# EAGLE design MAPE-CUN-Large-022 (EAGLE 7.3.0)
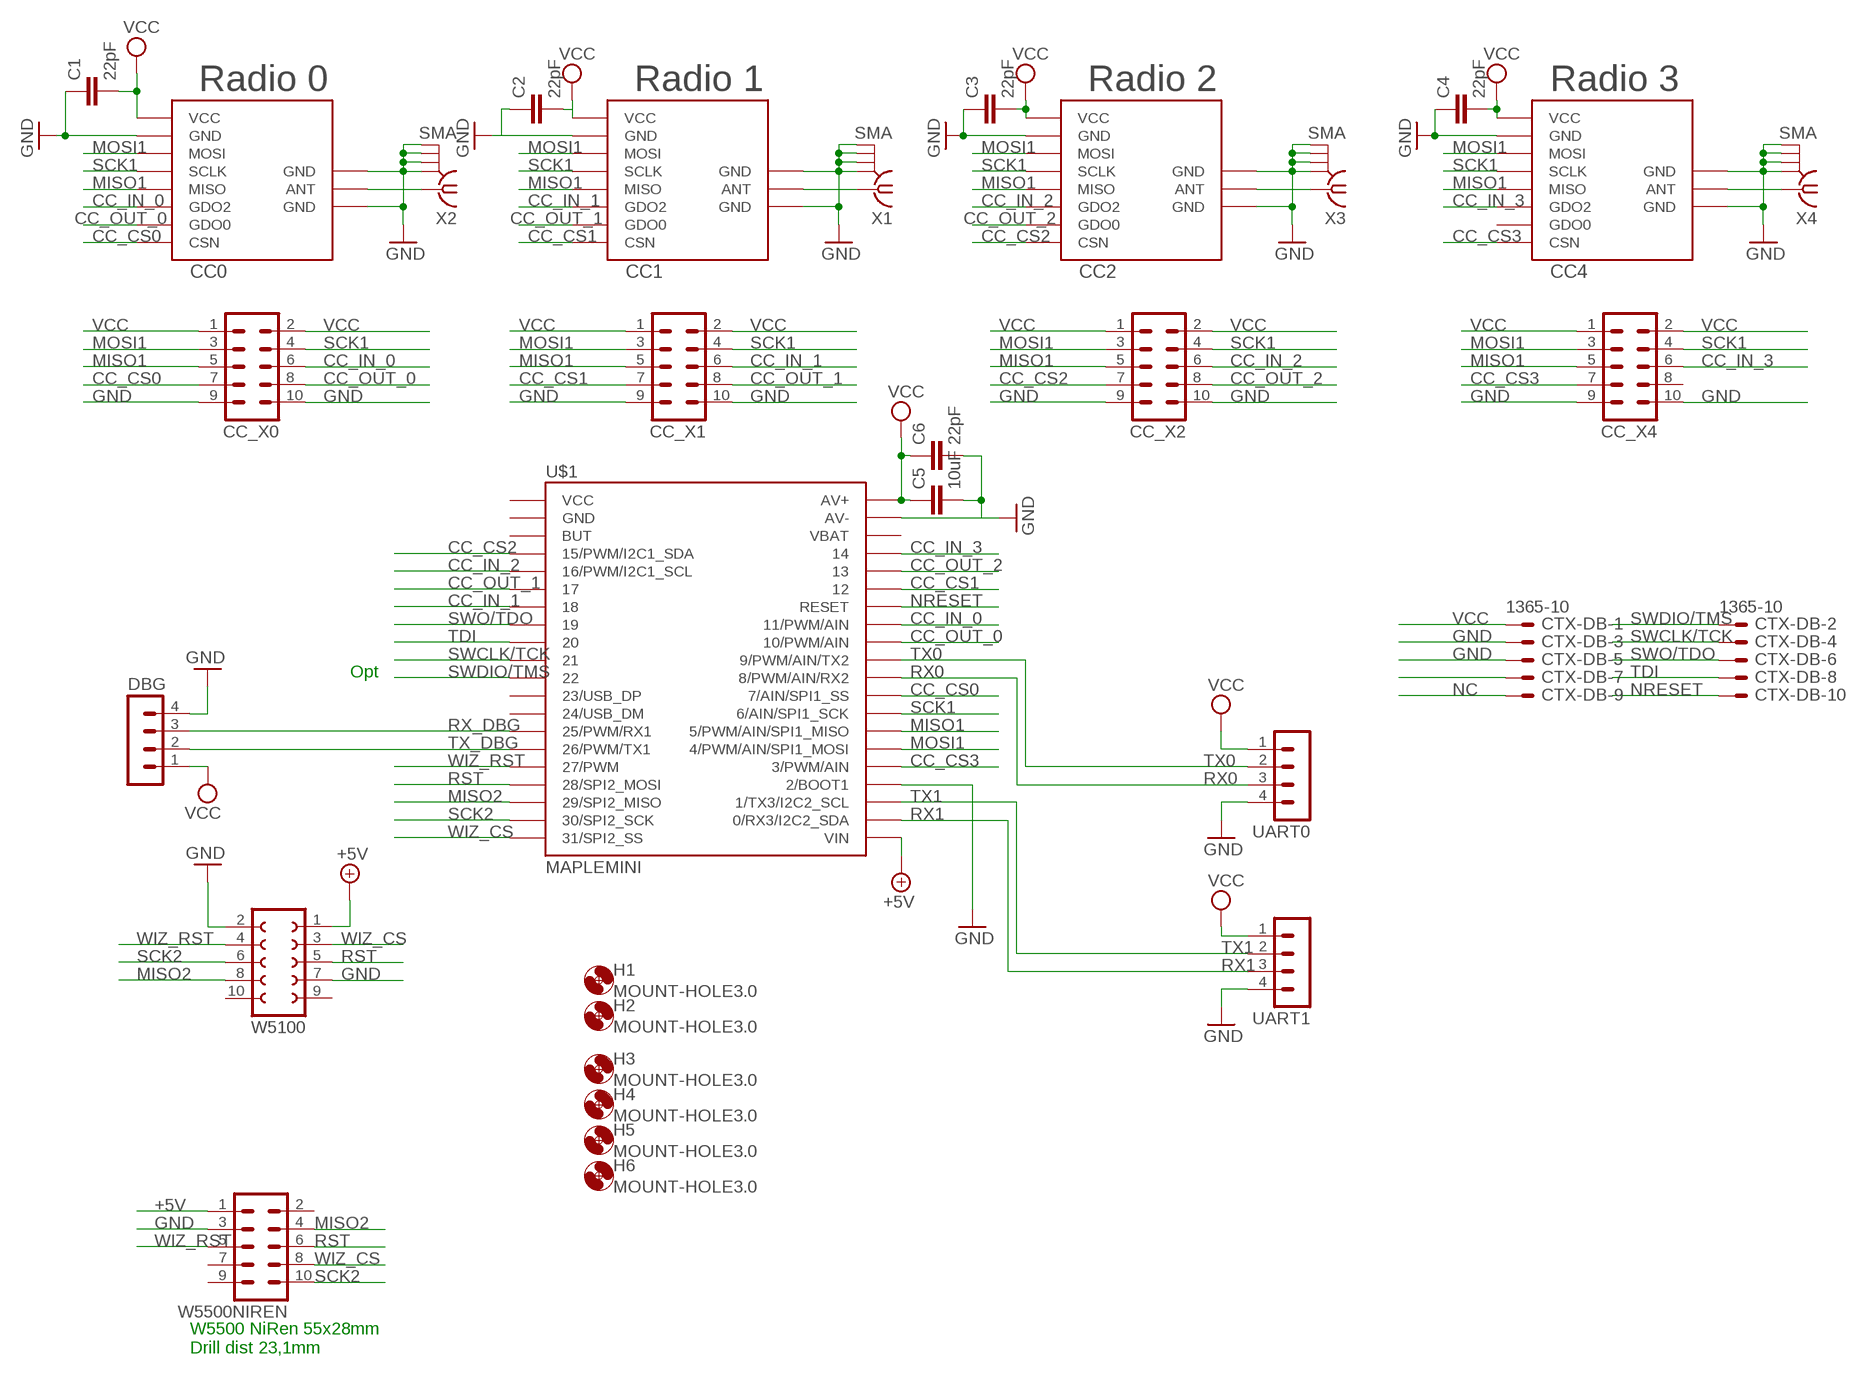
[diagram p0: schematic, sheet 1]

## Parts
C1  22pF  C-EUC0805  [C0805]
C2  22pF  C-EUC0805  [C0805]
C3  22pF  C-EUC0805  [C0805]
C4  22pF  C-EUC0805  [C0805]
C5  10uF  C-EUC1210  [C1210]
C6  22pF  C-EUC0805  [C0805]
CC0  CC1101_MODULE1SMD  [CC1101_MODULE1_SMD]
CC1  CC1101_MODULE1SMD  [CC1101_MODULE1_SMD]
CC2  CC1101_MODULE1SMD  [CC1101_MODULE1_SMD]
CC4  CC1101_MODULE1SMD  [CC1101_MODULE1_SMD]
CC_X0  MA05-2  [MA05-2]
CC_X1  MA05-2  [MA05-2]
CC_X2  MA05-2  [MA05-2]
CC_X4  MA05-2  [MA05-2]
CTX-DB  1365-10  [1365-10]
DBG  MA04-1  [MA04-1]
H1  MOUNT-HOLE3.0  [3,0]
H2  MOUNT-HOLE3.0  [3,0]
H3  MOUNT-HOLE3.0  [3,0]
H4  MOUNT-HOLE3.0  [3,0]
H5  MOUNT-HOLE3.0  [3,0]
H6  MOUNT-HOLE3.0  [3,0]
U$1  MAPLEMINI  [20-DIP]
UART0  MA04-1  [MA04-1]
UART1  MA04-1  [MA04-1]
W5100  FE05-2  [FE05-2]
W5500NIREN  MA05-2  [MA05-2]
X1  SMA  [SMA]
X2  SMA  [SMA]
X3  SMA  [SMA]
X4  SMA  [SMA]

## Nets
+5V: U$1.21(VIN) W5100.1 W5500NIREN.1
CC_CS0: CC0.CSN CC_X0.7 U$1.29(7/AIN/SPI1_SS)
CC_CS1: CC1.CSN CC_X1.7 U$1.35
CC_CS2: CC2.CSN CC_X2.7 U$1.4(15/PWM/I2C1_SDA)
CC_CS3: CC4.CSN CC_X4.7 U$1.25(3/PWM/AIN)
CC_IN_0: CC0.GDO2 CC_X0.6 U$1.33(11/PWM/AIN)
CC_IN_1: CC1.GDO2 CC_X1.6 U$1.7
CC_IN_2: CC2.GDO2 CC_X2.6 U$1.5(16/PWM/I2C1_SCL)
CC_IN_3: CC4.GDO2 CC_X4.6 U$1.37
CC_OUT_0: CC0.GDO0 CC_X0.8 U$1.32(10/PWM/AIN)
CC_OUT_1: CC1.GDO0 CC_X1.8 U$1.6
CC_OUT_2: CC2.GDO0 CC_X2.8 U$1.36
GND: C1.1 C2.1 C3.1 C4.1 C5.2 C6.2 CC0.GND@0(GND) CC0.GND@1(GND) CC0.GND@2(GND) CC1.GND@0(GND) CC1.GND@1(GND) CC1.GND@2(GND) CC2.GND@0(GND) CC2.GND@1(GND) CC2.GND@2(GND) CC4.GND@0(GND) CC4.GND@1(GND) CC4.GND@2(GND) CC_X0.9 CC_X0.10 CC_X1.9 CC_X1.10 CC_X2.9 CC_X2.10 CC_X4.9 CC_X4.10 CTX-DB.3 CTX-DB.5 DBG.4 U$1.24(2/BOOT1) U$1.39(AV-) UART0.4 UART1.4 W5100.2 W5100.7 W5500NIREN.3 X1.GND@1 X1.GND@2 X1.GND@3 X1.GND@4 X2.GND@1 X2.GND@2 X2.GND@3 X2.GND@4 X3.GND@1 X3.GND@2 X3.GND@3 X3.GND@4 X4.GND@1 X4.GND@2 X4.GND@3 X4.GND@4
MISO1: CC0.MISO CC1.MISO CC2.MISO CC4.MISO CC_X0.5 CC_X1.5 CC_X2.5 CC_X4.5 U$1.27(5/PWM/AIN/SPI1_MISO)
MISO2: U$1.18(29/SPI2_MISO) W5100.8 W5500NIREN.4
MOSI1: CC0.MOSI CC1.MOSI CC2.MOSI CC4.MOSI CC_X0.3 CC_X1.3 CC_X2.3 CC_X4.3 U$1.26(4/PWM/AIN/SPI1_MOSI)
N$1: CC2.ANT X3.1
N$2: CC4.ANT X4.1
N$3: CC1.ANT X1.1
N$4: CC0.ANT X2.1
N$8: CTX-DB.7
NC: CTX-DB.9
NRESET: CTX-DB.10 U$1.34(RESET)
RST: U$1.17(28/SPI2_MOSI) W5100.5 W5500NIREN.6
RX0: U$1.30(8/PWM/AIN/RX2) UART0.3
RX1: U$1.22(0/RX3/I2C2_SDA) UART1.3
RX_DBG: DBG.3 U$1.14(25/PWM/RX1)
SCK1: CC0.SCLK CC1.SCLK CC2.SCLK CC4.SCLK CC_X0.4 CC_X1.4 CC_X2.4 CC_X4.4 U$1.28(6/AIN/SPI1_SCK)
SCK2: U$1.19(30/SPI2_SCK) W5100.6 W5500NIREN.10
SWCLK/TCK: CTX-DB.4 U$1.10
SWDIO/TMS: CTX-DB.2 U$1.11
SWO/TDO: CTX-DB.6 U$1.8
TDI: CTX-DB.8 U$1.9
TX0: U$1.31(9/PWM/AIN/TX2) UART0.2
TX1: U$1.23(1/TX3/I2C2_SCL) UART1.2
TX_DBG: DBG.2 U$1.15(26/PWM/TX1)
VCC: C1.2 C2.2 C3.2 C4.2 C5.1 C6.1 CC0.VCC CC1.VCC CC2.VCC CC4.VCC CC_X0.1 CC_X0.2 CC_X1.1 CC_X1.2 CC_X2.1 CC_X2.2 CC_X4.1 CC_X4.2 CTX-DB.1 DBG.1 U$1.40(AV+) UART0.1 UART1.1
WIZ_CS: U$1.20(31/SPI2_SS) W5100.3 W5500NIREN.8
WIZ_RST: U$1.16(27/PWM) W5100.4 W5500NIREN.5
Unconnected: CC4.GDO0 CC_X4.8 U$1.1(VCC) U$1.2(GND) U$1.3(BUT) U$1.12(23/USB_DP) U$1.13(24/USB_DM) U$1.38(VBAT) W5100.9 W5100.10 W5500NIREN.2 W5500NIREN.7 W5500NIREN.9

## Notes on the sheet
- Radio 0 | Radio 1 | Radio 2 | Radio 3
- Opt
- W5500 NiRen 55x28mm
  Drill dist 23,1mm

## Library data of the parts
C1-C6 = rcl:C-EU: CAPACITOR, European symbol
CC0 CC1 CC2 CC4 = wireless:CC1101_MODULE1: CC1101 wireless module for 433/868 MHz (sold from Aliexpress). DIL version for mounting with pin header (and SMD soldering) and SMD only variant available.
CC_X0 CC_X1 CC_X2 CC_X4 W5500NIREN = con-lstb:MA05-2: PIN HEADER; OC_FARNELL: unknown; OC_NEWARK: unknown
CTX-DB = con-leotronics:1365-10: DUAL ROW STRAIGHT HEADER 1364 SERIES. 1.27mm x 1.27mm. Without Fixing Post. SMT Source: http://www.leotronics.co.uk/Conexcon/Data%20Sheets/sec.%20A/1364ing.pdf; OC_FARNELL: unknown; OC_NEWARK: unknown
DBG UART0 UART1 = con-lstb:MA04-1: PIN HEADER; OC_FARNELL: unknown; OC_NEWARK: unknown
H1-H6 = holes:MOUNT-HOLE: MOUNTING HOLE with drill center marker
U$1 = maplemini-small:MAPLEMINI
W5100 = con-lsta:FE05-2: FEMALE HEADER; OC_FARNELL: unknown; OC_NEWARK: unknown
X1-X4 = sma:SMA: SMA 50 Ohm end launch jack receptacle - round contact

## Net classes
0 default: width 0.406 mm
1 PWR: width 0.305 mm

## Board
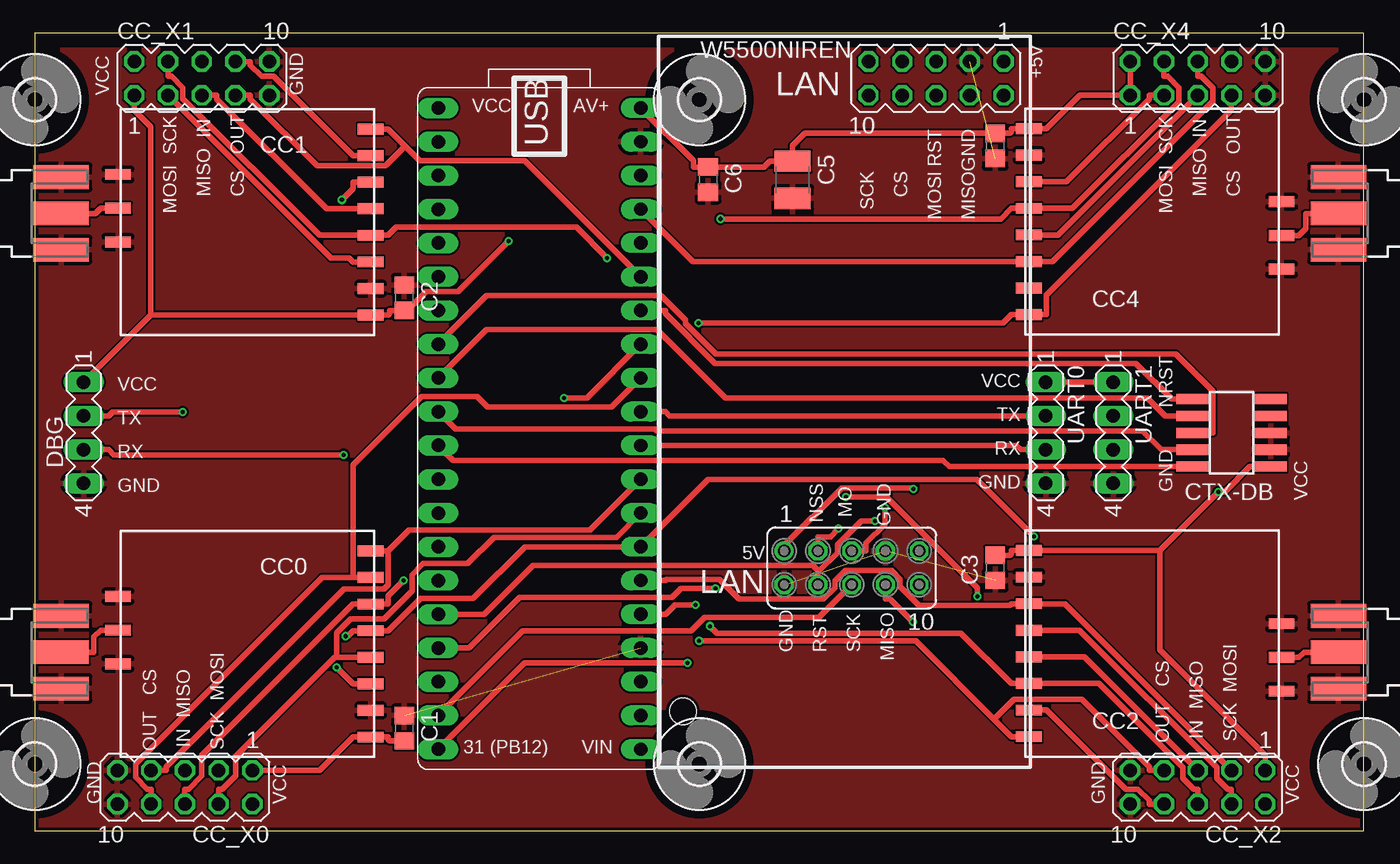
[diagram p1: board, top side]
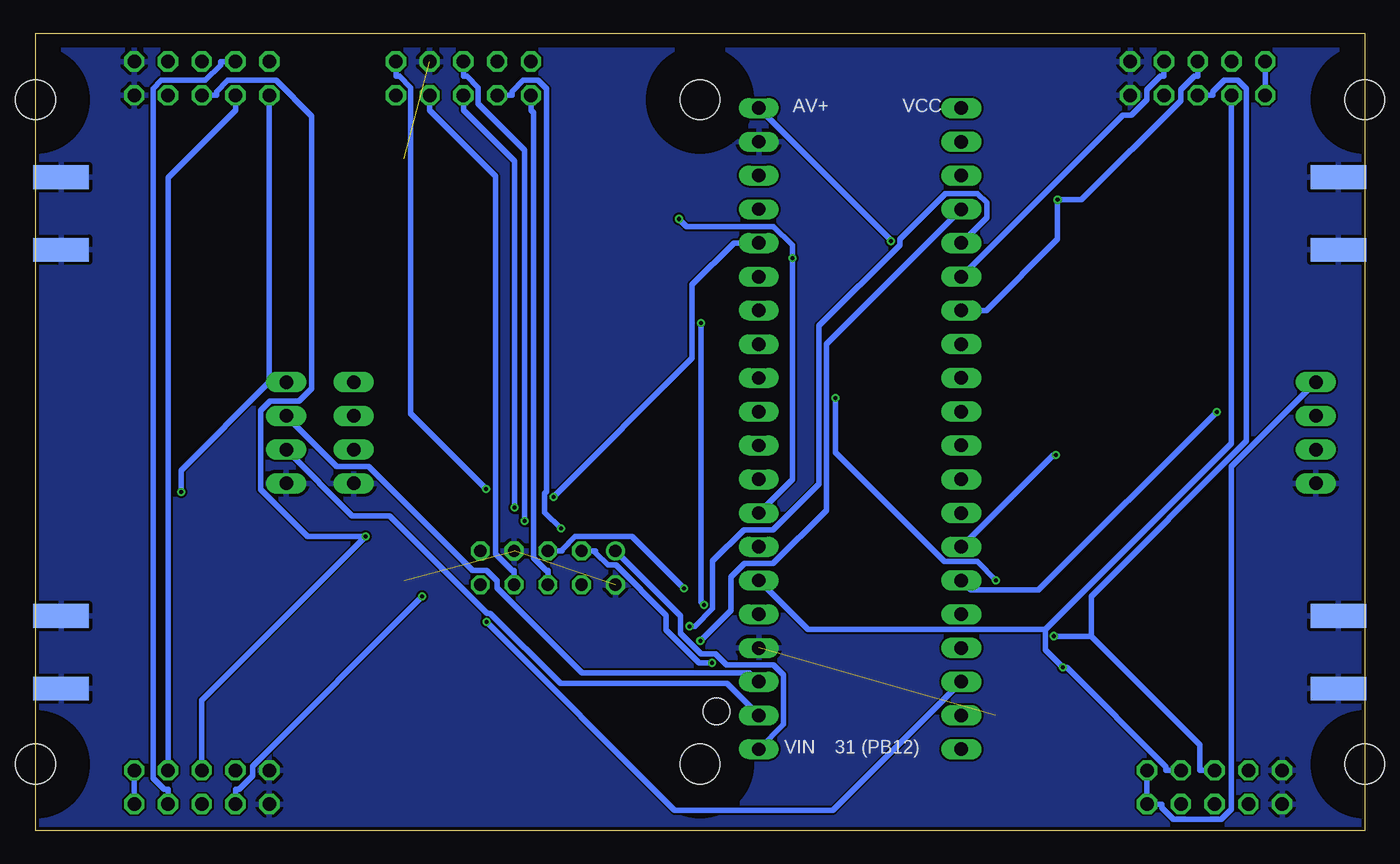
[diagram p2: board, bottom side, seen from below]

Size 100 x 60 mm. Coordinates in mm from the lower left corner, seen from the top.
Outline: 0,60 0,0 100,0 100,60 0,60
Copper layers (1*16): Top 0.035mm / dielectric 1.5mm / Bottom 0.035mm
Design rules "SeeedStudio_2layer_DRU_no_angle_20140221": minimum track width 6mil, minimum drill 12mil, track to track 6mil, track to pad 6mil, pad to pad 6mil, via to via 6mil, smd to smd 0mil, copper to edge 10mil, drill to drill 10mil, minimum pad ring 10mil, minimum via ring 6mil, stop-mask expansion 2mil, vias tented up to drill 100mil, thermal gap 10mil
Holes 2 mm at 48.76,8.97
tRestrict: area -0.1,59.1 to 100.2,59.8
bRestrict: area -0.1,59.1 to 100.2,59.8

### Footprints (pad centres in the part's own frame; a part is rotated, then mirrored left to right if it is on the bottom)
C0805 = smd 1.3 x 1.5: 1 -0.95,0; 2 0.95,0
C1210 = smd 1.6 x 2.7: 1 -1.4,0; 2 1.4,0
CC1101_MODULE1_SMD = smd 1.93 x 0.813: ANT 19,5.96; CSN 0,0; GDO0 0,2; GDO2 0,4; GND@0 0,12; GND@1 19,8.5; GND@2 19,3.42; MISO 0,6; MOSI 0,10; SCLK 0,8; VCC 0,14
MA05-2 = drill 1.016 octagon: 1 -5.08,-1.27; 2 -5.08,1.27; 3 -2.54,-1.27; 4 -2.54,1.27; 5 0,-1.27; 6 0,1.27; 7 2.54,-1.27; 8 2.54,1.27; 9 5.08,-1.27; 10 5.08,1.27
1365-10 = smd 0.76 x 2.4: 1 -2.54,-2.95; 2 -2.54,2.95; 3 -1.27,-2.95; 4 -1.27,2.95; 5 0,-2.95; 6 0,2.95; 7 1.27,-2.95; 8 1.27,2.95; 9 2.54,-2.95; 10 2.54,2.95
MA04-1 = drill 1.016 long: 1 -3.81,0; 2 -1.27,0; 3 1.27,0; 4 3.81,0
3,0 = hole 3: 0,0
20-DIP = drill 1.016 pad 1.27 long: 1 -24.13,-7.62; 2 -21.59,-7.62; 3 -19.05,-7.62; 4 -16.51,-7.62; 5 -13.97,-7.62; 6 -11.43,-7.62; 7 -8.89,-7.62; 8 -6.35,-7.62; 9 -3.81,-7.62; 10 -1.27,-7.62; 11 1.27,-7.62; 12 3.81,-7.62; 13 6.35,-7.62; 14 8.89,-7.62; 15 11.43,-7.62; 16 13.97,-7.62; 17 16.51,-7.62; 18 19.05,-7.62; 19 21.59,-7.62; 20 24.13,-7.62 | drill 1 pad 1.27 long: 21 24.13,7.62; 22 21.59,7.62; 23 19.05,7.62; 24 16.51,7.62; 25 13.97,7.62; 26 11.43,7.62; 27 8.89,7.62; 28 6.35,7.62; 29 3.81,7.62; 30 1.27,7.62; 31 -1.27,7.62; 32 -3.81,7.62; 33 -6.35,7.62; 34 -8.89,7.62; 35 -11.43,7.62; 36 -13.97,7.62; 37 -16.51,7.62; 38 -19.05,7.62; 39 -21.59,7.62; 40 -24.13,7.62
FE05-2 = drill 0.914: 1 -5.08,1.27 | drill 0.914 octagon: 2 -5.08,-1.27; 3 -2.54,1.27; 4 -2.54,-1.27; 5 0,1.27; 6 0,-1.27; 7 2.54,1.27; 8 2.54,-1.27; 9 5.08,1.27; 10 5.08,-1.27
SMA = smd 4.191 x 1.778: 1 2.115,0; GND@1 2.115,2.733; GND@2 2.115,-2.733 | smd 4.191 x 1.778 bottom: GND@3 2.115,2.733; GND@4 2.115,-2.733

### Placement (x,y rotation side)
C1  27.8,7.71 270 top
C2  27.8,40.09 270 top
C3  72.25,19.77 90 top
C4  72.25,51.52 90 top
C5  57.01,48.98 270 top
C6  50.66,48.98 270 top
CC0  25.26,21.04 180 top
CC1  25.26,52.79 180 top
CC2  74.79,7.07 0 top
CC4  74.79,38.82 0 top
CC_X0  11.29,3.26 180 top
CC_X1  12.56,56.6 0 top
CC_X2  87.49,3.26 180 top
CC_X4  87.49,56.6 0 top
CTX-DB  90.03,29.93 90 top
DBG  3.67,29.93 270 top
H1  100,5 0 top
H2  100,55 90 top
H3  0,5 0 top
H4  0,55 0 top
H5  50,5 0 top
H6  50,55 0 top
U$1  37.96,30.25 270 top
UART0  76.06,29.93 270 top
UART1  81.14,29.93 270 top
W5100  61.45,19.77 0 top
W5500NIREN  67.8,56.6 180 top
X1  -0.14,46.44 0 top
X2  -0.14,13.42 0 top
X3  100.19,13.42 180 top
X4  100.19,46.44 180 top

### Tracks (layer width: path | path; a pad name or v marks a point on that pad's centre or on a via)
+5V  (via drill 0.3 pad 0.61)
  Top 0.406: v66.1,25.71 66.02,25.78 60.71,25.78 56.38,21.45 W5100.1
  Bottom 0.406: W5100.1 51.48,16.15 51.48,14.83 49.95,13.29 48.84,13.29 48.02,12.47 44.46,12.47 43.71,11.71 43.71,7.99 U$1.21 | W5500NIREN.1 72.89,56.75 72.61,56.75 71.77,55.91 71.77,31.38 v66.1,25.71
CC_CS0
  Top 0.406: CC_X0.7 9.87,4.53 9.87,4.81 23.26,18.2 26.29,18.2 26.58,18.49 26.58,21.04 | CC0.CSN 26.58,21.04 | U$1.29 41.77,22.63 28.17,22.63 26.58,21.04
CC_CS1
  Top 0.406: 27.86,51.51 26.58,52.79 CC1.CSN | U$1.35 36.84,50.42 28.96,50.42 27.86,51.51 | 27.86,51.51 26.38,50.03 21.24,50.03 16.22,55.05 16.22,55.33 CC_X1.7
CC_CS2  (via drill 0.3 pad 0.61)
  Top 0.406: 72.17,8.37 73.47,7.07 CC2.CSN | v49.98,14.26 66.28,14.26 72.17,8.37 | 72.17,8.37 73.66,9.86 78.78,9.86 83.83,4.81 83.83,4.53 CC_X2.7
  Bottom 0.406: U$1.4 40.5,36.6 40.5,24.1 44.52,20.09 46.67,20.09 47.67,19.09 47.67,16.58 v49.98,14.26
CC_CS3  (via drill 0.3 pad 0.61)
  Top 0.406: U$1.25 47.44,16.28 48.15,16.98 v49.71,16.98 | v49.93,38.18 72.83,38.18 73.47,38.82 CC4.CSN 76.11,38.82 76.11,40.29 90.03,54.21 CC_X4.7
  Bottom 0.406: v49.71,16.98 49.93,17.2 v49.93,38.18
CC_IN_0  (via drill 0.3 pad 0.61)
  Top 0.406: U$1.33 41.55,32.56 v39.83,32.56 | v27.73,18.82 26.58,17.67 26.58,17.04 CC0.GDO2 23.94,17.04 12.56,5.66 12.56,4.1 11.56,3.11 11.29,3.11 CC_X0.6
  Bottom 0.406: v39.83,32.56 39.83,28.45 31.61,20.24 29.15,20.24 v27.73,18.82
CC_IN_1  (via drill 0.3 pad 0.61)
  Top 0.406: CC1.GDO2 23.94,48.79 23.94,48.3 v23.1,47.46
  Bottom 0.406: CC_X1.6 12.56,56.75 12.83,56.75 13.83,55.76 13.83,54.94 21.31,47.46 v23.1,47.46 23.1,44.5 28.46,39.14 U$1.7
CC_IN_2  (via drill 0.3 pad 0.61)
  Top 0.406: v50.79,15.38 51.32,14.85 69.69,14.85 73.47,11.07 CC2.GDO2 80.06,11.07 86.37,4.76 86.37,3.95 87.21,3.11 87.49,3.11 CC_X2.6
  Bottom 0.406: U$1.5 28.43,46.13 28.43,47.25 29.12,47.94 31.55,47.94 34.97,44.52 34.97,44.07 41.06,37.99 41.06,26.09 44.52,22.63 46.7,22.63 49.05,20.27 49.05,16.71 50.38,15.38 v50.79,15.38
CC_IN_3
  Top 0.406: U$1.37 49.52,42.82 CC4.GDO2 76.56,42.82 88.62,54.88 88.62,55.89 87.76,56.75 87.49,56.75 CC_X4.6
CC_OUT_0
  Top 0.406: CC_X0.8 8.75,3.11 8.47,3.11 7.59,3.99 7.59,5.01 21.62,19.04 23.94,19.04 | CC0.GDO0 23.94,19.04 | U$1.32 43.4,31.88 34.07,31.88 33.28,32.67 29.11,32.67 23.94,27.5 23.94,19.04
CC_OUT_1
  Top 0.406: CC1.GDO0 23.94,50.79 17.98,56.75 17.06,56.75 16.22,57.59 16.22,57.87 CC_X1.8
  Bottom 0.406: CC_X1.8 15.1,56.75 15.37,56.75 16.37,55.76 16.37,55 17.54,53.82 18.19,53.82 U$1.6
CC_OUT_2  (via drill 0.3 pad 0.61)
  Top 0.406: v70.91,17.62 70.91,18.27 64.07,25.11 v61.03,25.11 | CC2.GDO0 76.11,9.07 82.07,3.11 82.99,3.11 83.83,2.27 83.83,1.99 CC_X2.8
  Bottom 0.406: v61.03,25.11 50.59,35.55 50.59,41.07 47.44,44.22 U$1.36 | CC_X2.8 84.95,3.11 84.68,3.11 83.68,4.1 83.68,4.85 v70.91,17.62
GND  (4 unrouted)
  pour Bottom: -0.14,59.78 -0.14,0.08 100.19,0.08 100.19,59.78
  pour Top: -0.14,0.08 -0.14,59.78 100.19,59.78 100.19,0.08
MISO1  (via drill 0.3 pad 0.61)
  Top 0.406: CC_X1.5 13.68,55.33 13.68,55.05 21.94,46.79 CC1.MISO | v23.37,14.63 23.53,14.63 23.94,15.04 CC0.MISO 25.32,15.04 26.58,15.04 29.01,17.47 32.98,17.47 36.87,21.36 43.72,21.36 45.27,21.36 U$1.27 50.64,26.41 70.87,26.41 v75.16,22.13 | CC_X4.5 76.98,44.82 CC4.MISO | CC_X2.5 78.95,13.07 CC2.MISO
  Bottom 0.406: 20.58,14.63 20.58,17.62 8.9,29.3 8.9,55.82 9.55,56.47 10.57,56.47 11.44,55.6 11.44,55.33 CC_X1.5 | 20.58,14.63 12.41,6.46 12.41,4.53 CC_X0.5 | v23.37,14.63 20.58,14.63 | CC_X4.5 86.37,55.33 86.37,55.61 85.53,56.45 81.91,56.45 79.23,53.77 79.23,33.26 80.15,32.34 82.34,32.34 83.06,31.63 83.06,25.65 79.54,22.13 v75.16,22.13 87.49,9.8 CC_X2.5
MISO2  (via drill 0.3 pad 0.61)
  Top 0.406: W5100.8 64,17.43 64.32,17.43 v66.06,15.69
  Bottom 0.406: W5100.8 64,19.57 64.13,19.57 65.38,20.82 65.38,49.25 70.34,54.21 W5500NIREN.4 | v66.06,15.69 51.91,1.54 40,1.54 U$1.18
MOSI1  (via drill 0.3 pad 0.61)
  Top 0.406: CC_X1.3 22.29,43.07 23.66,43.07 23.94,42.79 CC1.MOSI | CC0.MOSI 23.94,11.04 23.94,11.06 v22.72,12.28 | CC_X4.3 83.83,55.33 83.83,55.05 77.6,48.82 CC4.MOSI | CC_X2.3 77.49,17.07 CC2.MOSI 73.47,17.07 73.36,16.96 66.53,16.96 65.09,18.39 65.09,18.94 64.47,19.57 60.98,19.57 60.19,18.77 60.19,18.26 59.35,17.42 52.96,17.42 51.49,18.89 47.51,18.89 47.44,18.82 U$1.26
  Bottom 0.406: CC_X4.3 84.95,54.21 90.03,49.13 CC_X2.3 | 24.03,15.12 10.02,29.13 CC_X1.3 | U$1.26 41.88,15.12 24.03,15.12 | 24.03,15.12 24.03,13.59 v22.72,12.28 22.42,12.28 14.95,4.8 14.95,4.53 CC_X0.3
N$1
  Top 0.406: CC2.ANT 95.11,13.03 95.5,13.42 X3.1
N$2
  Top 0.406: X4.1 95.62,46.44 95.62,45.29 95.11,44.78 CC4.ANT
N$3
  Top 0.406: CC1.ANT 4.94,46.83 4.55,46.44 X1.1
N$4
  Top 0.406: X2.1 4.43,13.42 4.43,14.57 4.94,15.08 CC0.ANT
NRESET
  Top 0.406: U$1.34 47.44,39.14 47.44,38.89 51.18,35.15 82.84,35.15 85.52,32.47 CTX-DB.10
RST  (via drill 0.3 pad 0.61)
  Top 0.406: v51.22,18.23 48.6,18.23 47.92,17.55 36.48,17.55 32.67,13.74 U$1.17 | W5100.5 62.52,21.04 62.52,21.63 63.95,23.05 v63.95,24.3
  Bottom 0.406: W5100.5 60.39,21.04 60.39,21.14 59.4,22.12 55.11,22.12 v51.22,18.23 | W5500NIREN.6 67.8,54.21 63.95,50.36 v63.95,24.3
RX0
  Top 0.406: UART0.3 74.18,28.66 73.86,28.98 U$1.30
RX1
  Bottom 0.406: UART1.3 76.16,23.68 73.34,23.68 66.01,16.35 65.79,16.35 60.5,11.06 47.99,11.06 U$1.22
RX_DBG  (via drill 0.3 pad 0.61)
  Top 0.406: DBG.3 5.55,28.66 5.93,28.28 v23.23,28.28
  Bottom 0.406: U$1.14 23.42,28.28 v23.23,28.28
SCK1  (via drill 0.3 pad 0.61)
  Top 0.406: 22.69,13.04 22.55,13.04 15.1,5.59 15.1,4.1 14.1,3.11 13.83,3.11 CC_X0.4 | 22.69,13.04 23.94,13.04 CC0.SCLK | U$1.28 43.75,22.07 34.55,22.07 32.57,20.09 29.23,20.09 28.39,19.25 28.39,18.04 26.29,15.94 23.74,15.94 22.69,14.88 22.69,13.04 | CC_X2.4 90.03,3.11 89.75,3.11 88.91,3.95 88.91,4.75 78.59,15.07 CC2.SCLK | v51.58,46.03 72.68,46.03 73.47,46.82 CC4.SCLK 76.11,46.82 78.07,46.82 86.08,54.83 86.08,55.89 85.22,56.75 84.95,56.75 CC_X4.4 | v43.05,43.09 40.74,45.4 27.19,45.4 26.58,44.79 CC1.SCLK 21.43,44.79 11.14,55.09 11.14,55.91 10.3,56.75 10.02,56.75 CC_X1.4
  Bottom 0.406: CC_X4.4 86.07,57.87 86.07,57.6 87.22,56.45 90.54,56.45 91.15,55.84 91.15,3.95 90.31,3.11 90.03,3.11 CC_X2.4 | v51.58,46.03 51.01,45.46 44.47,45.46 43.05,44.04 v43.05,43.09 43.05,26.43 U$1.28
SCK2
  Top 0.406: W5100.6 58.99,16.04 50.38,16.04 49.36,15.02 36.7,15.02 U$1.19
  Bottom 0.406: W5100.6 61.45,19.57 61.59,19.57 62.52,20.5 62.52,54.01 62.73,54.21 W5500NIREN.10
SWCLK/TCK
  Top 0.406: U$1.10 31.65,30.2 46.68,30.2 46.8,30.08 83.33,30.08 84.75,28.66 CTX-DB.4
SWDIO/TMS
  Top 0.406: CTX-DB.2 68.8,27.39 68.33,27.86 31.46,27.86 U$1.11
SWO/TDO
  Top 0.406: U$1.8 34,40.26 47.11,40.26 48.97,38.41 48.97,38.16 51.25,35.87 85.83,35.87 88.64,33.07 88.64,29.93 CTX-DB.6
TDI
  Top 0.406: U$1.9 33.99,37.71 46.79,37.71 51.95,32.55 83.72,32.55 85.07,31.2 CTX-DB.8
TX0
  Top 0.406: U$1.31 47.44,31.52 47.76,31.2 UART0.2
TX1
  Bottom 0.406: U$1.23 46.27,11.88 58.89,11.88 65.27,18.26 65.27,18.77 66.06,19.57 67.12,19.57 74.94,27.39 77.33,27.39 UART1.2
TX_DBG  (via drill 0.3 pad 0.61)
  Top 0.406: DBG.2 5.55,31.2 5.86,31.5 v11.13,31.5
  Bottom 0.406: U$1.15 29.62,18.1 24.54,18.1 v11.13,31.5
VCC  (via drill 0.3 pad 0.61)
  Top 0.406: CC_X0.1 21.43,4.53 23.94,7.04 CC0.VCC 26.58,7.04 26.58,6.87 26.69,6.75 C1.2 | v35.63,44.35 31.85,40.56 29.42,40.56 28,39.14 C2.2 26.69,39.14 26.69,38.9 26.58,38.79 CC1.VCC 8.72,38.79 | CC_X2.1 92.57,5.65 84.63,13.59 84.63,21.07 | 84.63,21.07 CC2.VCC 73.47,21.07 73.47,20.83 73.36,20.72 C3.2 | 84.63,21.07 v89.05,25.48 89.52,25.48 91.42,27.39 CTX-DB.1 | U$1.40 49.55,50.4 49.55,49.93 C6.1 54.85,49.93 55.3,50.38 C5.1 57.01,51.54 57.94,52.47 C4.2 73.36,52.47 73.47,52.58 73.47,52.82 CC4.VCC 76.11,52.82 78.62,55.33 CC_X4.1 82.41,56.75 CC_X4.2 | 8.72,38.79 DBG.1 | 8.72,38.79 8.72,52.97 7.48,54.21 CC_X1.1 | UART1.1 UART0.1
  Bottom 0.406: U$1.40 35.63,44.43 v35.63,44.35 | 82.41,33.74 82.41,54.21 CC_X4.1 | UART1.1 82.41,33.74 | 82.41,33.74 89.05,27.11 v89.05,25.48 | DBG.1 10.02,27.39 10.02,1.61 10.78,0.85 14.39,0.85 15.25,1.72 15.25,1.99 CC_X0.2 CC_X0.1 | CC_X1.2 CC_X1.1 | CC_X2.2 CC_X2.1
WIZ_CS  (via drill 0.3 pad 0.61)
  Top 0.406: v49.12,12.63 36.85,12.63 U$1.20 | W5100.3 58.91,22.11 59.84,22.11 v60.46,22.73
  Bottom 0.406: W5100.3 57.85,21.04 57.85,20.91 56.91,19.97 56.33,19.97 52.57,16.21 52.57,15.11 50.09,12.63 v49.12,12.63 | v60.46,22.73 61.69,23.95 61.69,25.38 61.56,25.51 61.56,55.81 62.2,56.45 63.31,56.45 64.15,55.61 64.15,55.33 W5500NIREN.8
WIZ_RST  (via drill 0.3 pad 0.61)
  Top 0.406: 58.91,19.57 58.52,19.96 37.49,19.96 33.81,16.28 U$1.16 | 58.91,19.57 58.91,19.43 W5100.4 | v63.21,23.29 62.2,23.29 60.38,21.48 60.38,20.9 59.05,19.57 58.91,19.57
  Bottom 0.406: W5500NIREN.5 67.8,56.75 67.53,56.75 66.69,55.91 66.69,54.69 63.21,51.21 v63.21,23.29

### Text on the board
tNames: +5V | VCC | GND | LAN | VCC | AV+ | IN | RST | GND | IN | USB | SCK | OUT | SCK | OUT | SCK | CS | MOSI | MISO | MISO | CS | MISO | CS | MOSI | MOSI | VCC | VCC | TX | NRST | TX | RX | RX | NSS | GND | GND | GND | GND | VCC | MO | 5V | LAN | MOSI | MOSI | GND | RST | SCK | CS | MISO | MISO | CS | MISO | OUT | SCK | OUT | SCK | IN | IN | 31 (PB12) | VIN | GND | VCC | GND | VCC
bNames: VCC | AV+ | 31 (PB12) | VIN